# Altium schematic sheet flexPCB_rev.SchDoc
size A3; SheetNumber: 1; SheetTotal: 1
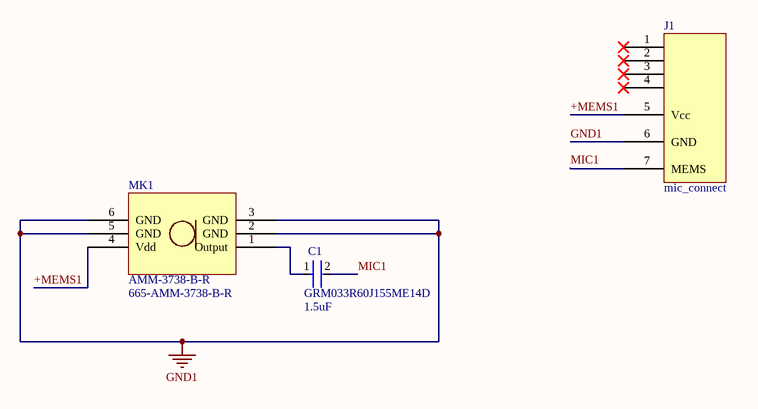
[diagram p0: flexPCB_rev.SchDoc]

## Parts
C1  GRM033R60J155ME14D  [FP-GRM033-0_03-IPC_B]
J1  mic_connect  [mic_connect]
MK1  AMM-3738-B-R  [665-AMM-3738-B-R]

## Nets
GND1: J1.6(GND) MK1.2(GND) MK1.3(GND) MK1.5(GND) MK1.6(GND)
+MEMS1: J1.5(Vcc) MK1.4(Vdd)
MIC1: C1.2 J1.7(MEMS)
NetC1_1: C1.1 MK1.1(Output)

Not connected (* = marked no-connect by the designer): J1 1* 2* 3* 4*

## Notes on the sheet
- (near C1) 1.5uF

## Library data of the parts
C1 = CMP-06035-017352-1: Chip Multilayer Ceramic Capacitors for General Purpose, 0201, 1.5uF, X5R, 15%, 20%, 6.3V; Case/Package: 0201; Packaging: Tape and Reel; Case Code (Imperial): 0201; Capacitance: 1.5uF; Max Operating Temperature: 85°C; Voltage Rating (DC): 6.3V; Dielectric: X5R; Min Operating Temperature: -55°C; Voltage Rating: 6.3V; Tolerance: 20%; Mount: Surface Mount; Case Code (Metric): 0603; Thickness: 0.013inch; Length: 0.024inch; Width: 0.012inch
MK1 = AMM-3738-B-R: Manufacturer: PUI Audio; Supplier 1: Mouser; Supplier Part Number 1: 665-AMM-3738-B-R